# Altium schematic sheet NTC.SchDoc
size 431 x 279 mm; SheetNumber: 1; SheetTotal: 4
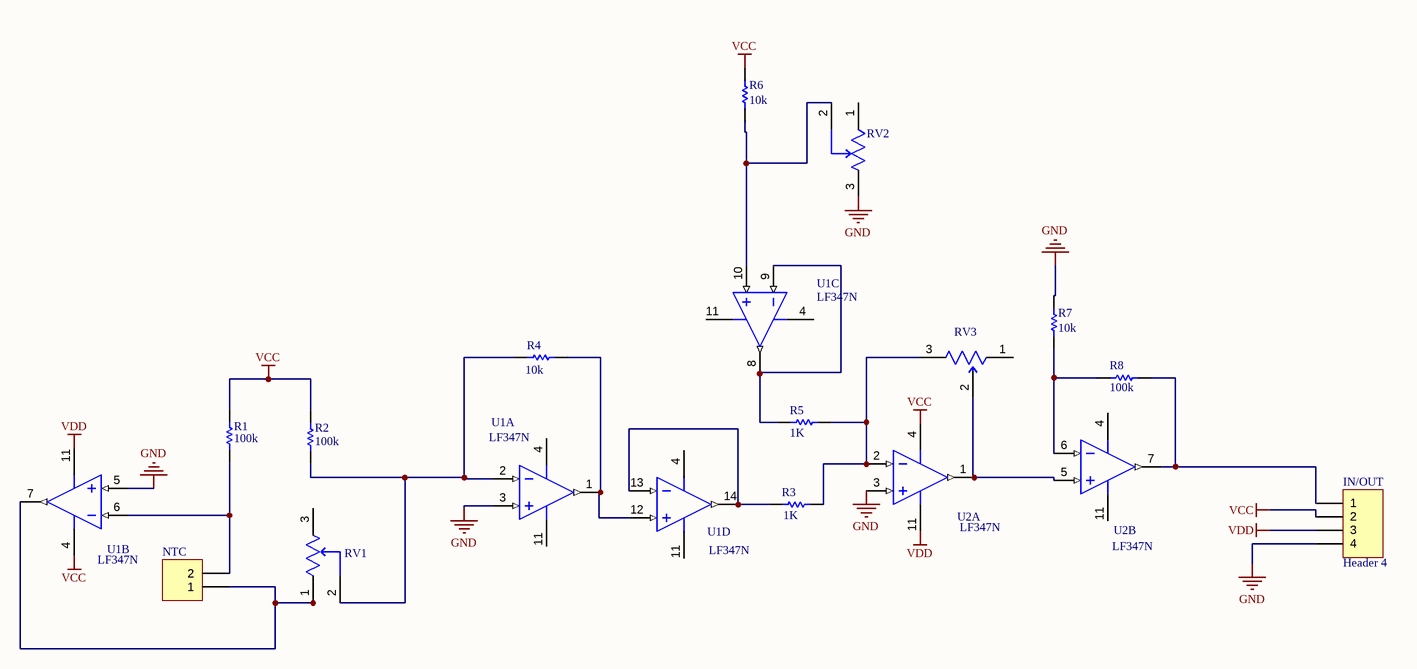
[diagram p0: NTC.SchDoc]

## Parts
IN/OUT  Header 4  [HDR1X4]
NTC  Thermoresistor  [MHDR1X2]  (value not drawn)
R1  value 100k  [AXIAL-0.3]  (hidden comment: Res1)
R2  value 100k  [AXIAL-0.3]  (hidden comment: Res1)
R3  value 1K  [AXIAL-0.3]  (hidden comment: Res1)
R4  value 10k  [AXIAL-0.3]  (hidden comment: Res1)
R5  value 1K  [AXIAL-0.3]  (hidden comment: Res1)
R6  value 10k  [AXIAL-0.3]  (hidden comment: Res1)
R7  value 10k  [AXIAL-0.3]  (hidden comment: Res1)
R8  value 100k  [AXIAL-0.3]  (hidden comment: Res1)
RV1  3296W-1-504LF  [FP-3296W-MFG]  (value not drawn)
RV2  3296W-1-504LF  [FP-3296W-MFG]  (value not drawn)
RV3  3006P-1-103LF  [FP-3006P-MFG]  (value not drawn)
U1  LF347N  [N0014A]  (parts A,B,C,D of 4)
U2  LF347N  [N0014A]  (parts A,B of 4)

## Nets
GND: IN/OUT.4 R7.2 RV2.3(CW) U1.3(IN1+) U1.5(IN2+) U2.3(IN1+)
VCC: IN/OUT.2 R1.2 R2.2 R6.2 U1.4(V+) U2.4(V+)
VDD: IN/OUT.3 U1.11(V-) U2.11(V-)
NetIN/OUT_1: IN/OUT.1 R8.2 U2.7(OUT2)
NetNTC_1: NTC.1 RV1.1(CCW) U1.7(OUT2)
NetNTC_2: NTC.2 R1.1 U1.6(IN2-)
NetR2_1: R2.1 R4.1 RV1.2(WIPER) U1.2(IN1-)
NetR3_1: R3.1 U1.13(IN4-) U1.14(OUT4)
NetR3_2: R3.2 R5.2 RV3.3(CW) U2.2(IN1-)
NetR4_2: R4.2 U1.1(OUT1) U1.12(IN4+)
NetR5_1: R5.1 U1.8(OUT3) U1.9(IN3-)
NetR6_1: R6.1 RV2.2(WIPER) U1.10(IN3+)
NetR7_1: R7.1 R8.1 U2.6(IN2-)
NetRV3_2: RV3.2(WIPER) U2.1(OUT1) U2.5(IN2+)

Not connected (* = marked no-connect by the designer): RV1 3(CW); RV2 1(CCW); RV3 1(CCW)

## Notes on the sheet
- DWG. NO.
- REV.
- SHT.
- THIS DOCUMENT AND THE DATA DISCLOSED HEREIN OR HEREWITH IS THE PROPERTY OF ALTIUM LIMITED AND MAY BE FREELY DISTRIBUTED IN WHOLE. NO RIGHTS ARE RESERVED OR EXPRESS OR IMPLIED WARANTEE GIVEN.
- REVISION
- DESCRIPTION
- DATE
- APPROVED
- ENG:
- APPROVALS
- PROJECT
- DSN:
- CHK:
- REFERENCE DOCUMENTS
- PROJECT REVISION:
- TITLE
- DOCUMENT REVISION:
- DESIGN ITEM:
- BOM:
- FAB DWG:
- PCB DWG:
- ASSY DWG:
- SCALE:
- SIZE
- B
- CAGE CODE
- FILE NAME
- DWG NO.
- SHEET
- OF
- REV

## Library data of the parts
IN/OUT = Header 4: Header, 4-Pin / 1 for out / 2 for Vcc / 3 for Vdd / 4 for GND; LatestRevisionDate: 17-Jul-2002; LatestRevisionNote: Re-released for DXP Platform.; Publisher: Altium Limited
NTC = MHDR1X2: Header, 2-Pin; LatestRevisionDate: 17-Jul-2002; LatestRevisionNote: Re-released for DXP Platform.; Publisher: Altium Limited
R1-R8 = Res1: Resistor; Published: 8-Jun-2000; LatestRevisionDate: 17-Jul-2002; LatestRevisionNote: Re-released for DXP Platform.; PackageReference: AXIAL-0.3; Publisher: Altium Limited; PackageDescription: Axial Device, Thru-Hole; 2 Leads; 0.3 in Pin Spacing
RV1 RV2 = CMP-2000-05583-2: TRIMMER 500K OHM 0.5W PC PIN TOP; Manufacturer: Bourns; Resistance: 1k; Temperature Coefficient: 100ppm/°C; Value: 725; Tolerance: 10%; Voltage Rating: 300V; Standoff Height: 0.38mm; ComponentLink2Description: Datasheet; Package: 3296W; Series: Trimpot 3296-Sealed; Lead Free: Yes; Octopart: https://octopart.com/3296w-1-504lf-bourns-143884; Device Class L2: Resistors; Automotive: No; RoHS: TRUE; Temperature Range High: +125°C; Manufacturer Part Number: 3296W-1-504LF; Height: 12.05mm; Power Rating: 0.5W; Temperature Range Low: -55°C; ComponentLink2URL: https://www.bourns.com/docs/Product-Datasheets/3296.pdf; Device Class L1: Passive Components; Device Class L3: Variable Resistors and Potentiometers; Category: Res; Temperature: -55°C to +125°C; Digikey Description: TRIMMER 500K OHM 0.5W PC PIN TOP; Mouser Description: Trimmer; Cermet; Rest 500 Kilohms; PCB; 25 Turns; Pwr-Rtg 0.5W
RV3 = CMP-07234-000047-1: TRIMMER 10KOHM 0.75W PC PIN SIDE; Manufacturer Series: 3006; Pin Diameter: 0.6mm; Resistance Tolerance: 10%; Actuator Type: SCREW; Number of Turns: 15; Insulation Resistance: 1GR; Pitch: 2.5mm; Power Rating: 750mW; Resistance Law: Linear; Temperature Coefficient: 100ppm/°C; Resistance: 50k; Number of Terminals/Pins: 3; Actuator Orientation: Horizontal; Package Quantity: 100; Depth: 4.83mm; Width: 4.83mm; Termination: Pin; Packaging: Rail/Tube; Height: 6.35mm; Terminal Finish: Tin; Color: Blue; Thickness: 5.59mm; Lead Free: Lead Free; Min Operating Temperature: -55°C; Type: Potentiometer; Radiation Hardening: No; Weight: 0.04oz; Mount: Panel; RoHS Compliant: Yes; Length: 20.57mm; Tolerance: 10%; Number of Pins: 3; Taper: Linear; Military Standard: Not; Resistor Type: Cermet; Max Operating Temperature: 125°C; REACH SVHC: No SVHC; Technology: CERMET; Max Power Dissipation: 750mW; Series: 3006
U1 U2 = CMP-0055-00229-3: Wide Bandwidth Quad JFET Input Operational Amplifier, 14-pin MDIP; Manufacturer: Texas Instruments; PowerWise: N; PackageTopMarking: NSUZXYYTTE#*LF347N; CompType: Amplifiers; RoHS: N; PinCount: 14; Package Reference: N0014A; PackageDescription: MDIP, .750 x .250 x.130in, 14 Lead, .100in Pitch; ComponentLink1Description: Datasheet URL; ComponentLink1URL: http://www.ti.com/general/docs/lit/getliterature.tsp?genericPartNumber=LF347&fileType=pdf; Code_JEDEC: MS-001-AA